# EAGLE schematic Jalousie_neueGS_REGCR_einlagig_AKL073 (EAGLE 5.00)
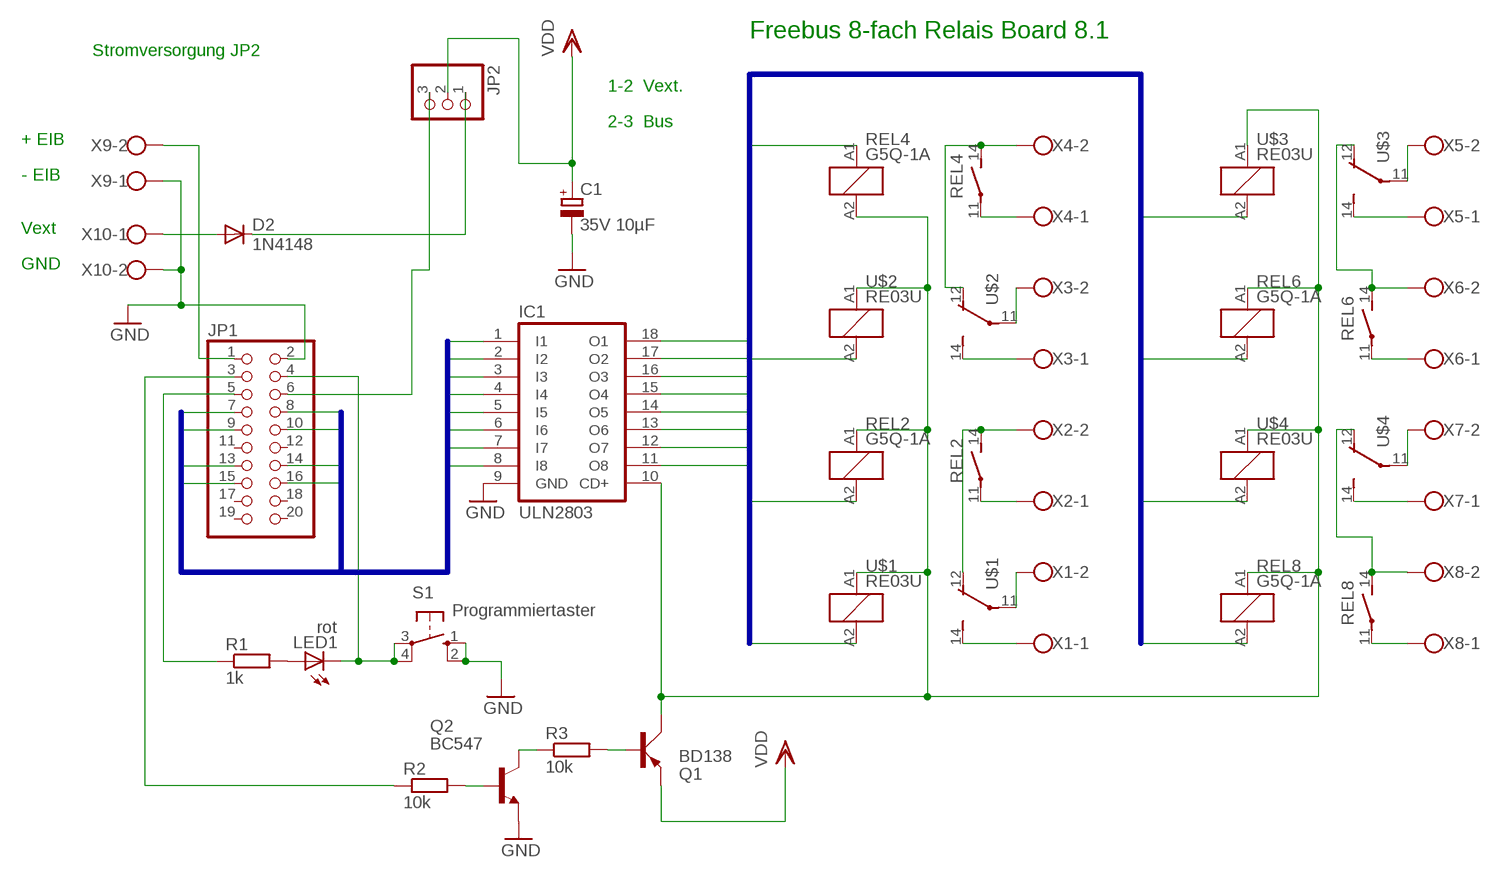
[diagram p0: schematic, sheet 1]

## Parts
C1  35V 10µF  CPOL-EUE5-8.5  [E5-8,5]
D2  1N4148  [DO35-10]
IC1  ULN2803  ULN2803A  [DIL18]
JP1  PINHD-2X10  [2X10]
JP2  PINHD-1X3  [1X03]
LED1  rot  LED3MM  [LED3MM]
Q1  BD138  BD140  [TO126AV]
Q2  BC547  [TO92]
R1  1k  R-EU_0207/10  [0207/10@1]
R2  10k  R-EU_0207/10  [0207/10@1]
R3  10k  R-EU_0207/10  [0207/10@1]
REL2  G5Q-1A  RE030024  [RE-SCHRACK]
REL4  G5Q-1A  RE030024  [RE-SCHRACK]
REL6  G5Q-1A  RE030024  [RE-SCHRACK]
REL8  G5Q-1A  RE030024  [RE-SCHRACK]
S1  Programmiertaster  10-XX  [B3F-10XX]
U$1  RE03U  [G5Q_1_EU]
U$2  RE03U  [G5Q_1_EU]
U$3  RE03U  [G5Q_1_EU]
U$4  RE03U  [G5Q_1_EU]
X1  W237-102  [W237-102]
X2  W237-102  [W237-102]
X3  W237-102  [W237-102]
X4  W237-102  [W237-102]
X5  W237-102  [W237-102]
X6  W237-102  [W237-102]
X7  W237-102  [W237-102]
X8  W237-102  [W237-102]
X9  W237-102  [W237-102]
X10  W237-102  [W237-102]

## Nets
EXTDC: D2.C JP2.1
GND: C1.- IC1.9(GND) JP1.2 Q2.1(E) S1.1(S) S1.2(S1) X9.1 X10.2
IO1: IC1.1(I1) JP1.16
IO2: IC1.2(I2) JP1.15
IO3: IC1.3(I3) JP1.14
IO4: IC1.4(I4) JP1.13
IO5: IC1.5(I5) JP1.10
IO6: IC1.6(I6) JP1.9
IO7: IC1.7(I7) JP1.8
IO8: IC1.8(I8) JP1.7
N$1: REL4.11(2:P) X4.1
N$2: REL4.14(2:S) U$2.12(14:O) X4.2
N$3: U$2.14(14:S) X3.1
N$4: U$2.11(14:P) X3.2
N$5: REL2.11(2:P) X2.1
N$6: REL2.14(2:S) U$1.12(14:O) X2.2
N$7: U$1.14(14:S) X1.1
N$8: U$1.11(14:P) X1.2
N$9: REL6.14(2:S) U$3.12(14:O) X6.2
N$10: REL6.11(2:P) X6.1
N$11: U$4.11(14:P) X7.2
N$12: REL8.11(2:P) X8.1
N$13: U$3.11(14:P) X5.2
N$14: U$3.14(14:S) X5.1
N$15: U$4.14(14:S) X7.1
N$16: REL8.14(2:S) U$4.12(14:O) X8.2
N$17: D2.A X10.1
N$19: IC1.10(CD+) Q1.C REL2.A1 REL4.A2 REL6.A1 REL8.A1 U$1.A1 U$2.A1 U$3.A1 U$4.A1
N$20: JP1.1 X9.2
N$24: JP1.5 R1.1
N$27: JP1.4 LED1.K(C) S1.3(P) S1.4(P1)
N$28: LED1.A R1.2
N$33: JP1.3 R2.1
N$37: Q1.B R3.2
N$38: Q2.3(C) R3.1
N$39: Q2.2(B) R2.2
R1: IC1.14(O5) REL4.A1
R2: IC1.13(O6) U$2.A2
R3: IC1.12(O7) REL2.A2
R4: IC1.11(O8) U$1.A2
R5: IC1.15(O4) U$3.A2
R6: IC1.16(O3) REL6.A2
R7: IC1.17(O2) U$4.A2
R8: IC1.18(O1) REL8.A2
VDD: C1.+ JP2.2 Q1.E
VERSORGUNG: JP1.6 JP2.3
Unconnected: JP1.11 JP1.12 JP1.17 JP1.18 JP1.19 JP1.20

## Buses
R[1..8]
IO[1..8]

## Notes on the sheet
- Freebus 8-fach Relais Board 8.1
- Stromversorgung JP2
- 1-2  Vext.
- 2-3  Bus
- + EIB
- - EIB
- Vext
- GND

## Library data of the parts
C1 = rcl:CPOL-EU: POLARIZED CAPACITOR, European symbol
D2 = diode:1N4148: DIODE high speed (Philips)
IC1 = uln-udn:ULN2803A: DRIVER ARRAY
JP1 = pinhead:PINHD-2X10: PIN HEADER
JP2 = pinhead:PINHD-1X3: PIN HEADER
LED1 = led:LED: LED OSRAM: - CHIPLED LG R971, LG N971, LY N971, LG Q971, LY Q971, LO R971, LY R971 LH N974, LH R974 LS Q976, LO Q976, LY Q976 LO Q996 - Hyper CHIPLED LW Q18S LB Q993, LB Q99A, LB R99A - SideLED LS A670, LO A670, LY A670, LG A670, LP A670 LB A673, LV A673, LT A673, LW A673 LH A674 LY A675 LS A676, LA A676, LO A676, LY A676, LW A676 LS A679, LY A679, LG A679 - Hyper Micro SIDELED® LS Y876, LA Y876, LO Y876, LY Y876 LT Y87S - SmartLED LW L88C, LW L88S LB L89C, LB L89S, LG L890 LS L89K, LO L89K, LY L89K LS L896, LA L896, LO L896, LY L896 - TOPLED LS T670, LO T670, LY T670, LG T670, LP T670 LSG T670, LSP T670, LSY T670, LOP T670, LYG T670 LG T671, LOG T671, LSG T671 LB T673, LV T673, LT T673, LW T673 LH T674 LS T676, LA T676, LO T676, LY T676, LB T676, LH T676, LSB T676, LW T676 LB T67C, LV T67C, LT T67C, LS T67K, LO T67K, LY T67K, LW E67C LS E67B, LA E67B, LO E67B, LY E67B, LB E67C, LV E67C, LT E67C LW T67C LS T679, LY T679, LG T679 LS T770, LO T770, LY T770, LG T770, LP T770 LB T773, LV T773, LT T773, LW T773 LH T774 LS E675, LA E675, LY E675, LS T675 LS T776, LA T776, LO T776, LY T776, LB T776 LHGB T686 LT T68C, LB T68C - Hyper Mini TOPLED® LB M676 - Mini TOPLED Santana® LG M470 LS M47K, LO M47K, LY M47K Source: http://www.osram.convergy.de - LUMILED® LXK2-PW12-R00, LXK2-PW12-S00, LXK2-PW14-U00, LXK2-PW14-V00 LXK2-PM12-R00, LXK2-PM12-S00, LXK2-PM14-U00 LXK2-PE12-Q00, LXK2-PE12-R00, LXK2-PE12-S00, LXK2-PE14-T00, LXK2-PE14-U00 LXK2-PB12-K00, LXK2-PB12-L00, LXK2-PB12-M00, LXK2-PB14-N00, LXK2-PB14-P00, LXK2-PB14-Q00 LXK2-PR12-L00, LXK2-PR12-M00, LXK2-PR14-Q00, LXK2-PR14-R00 LXK2-PD12-Q00, LXK2-PD12-R00, LXK2-PD12-S00 LXK2-PH12-R00, LXK2-PH12-S00 LXK2-PL12-P00, LXK2-PL12-Q00, LXK2-PL12-R00 Source: www.luxeon.com
Q1 = transistor-power:BD140: PNP TRANSISTOR
Q2 = transistor-npn:BC547*: NPN Transistor
R1-R3 = rcl:R-EU_: RESISTOR, European symbol
REL2 REL4 REL6 REL8 = relay:RE03*: Miniature PCB Relay 1 pole 6 A SCHRACK Source: http://www.schrack.com/.. 5812.pdf
S1 = switch-omron:10-XX: OMRON SWITCH
U$1-U$4 = freebus_relay:RE03U
X1-X10 = con-wago-500:W237-102: WAGO SCREW CLAMP